# Altium schematic sheet Main.SchDoc
size A2; DocumentNumber: 1; SheetNumber: 1; SheetTotal: 2; Organization: Công ty cổ phần giải pháp và thiết bị VHB Việt Nam; Address1: KDT Dương Nội, Hà Đông, Hà Nội; SPICEModelCache: <root> / <DocumentId>GUMLTXHH</DocumentId> / </root>
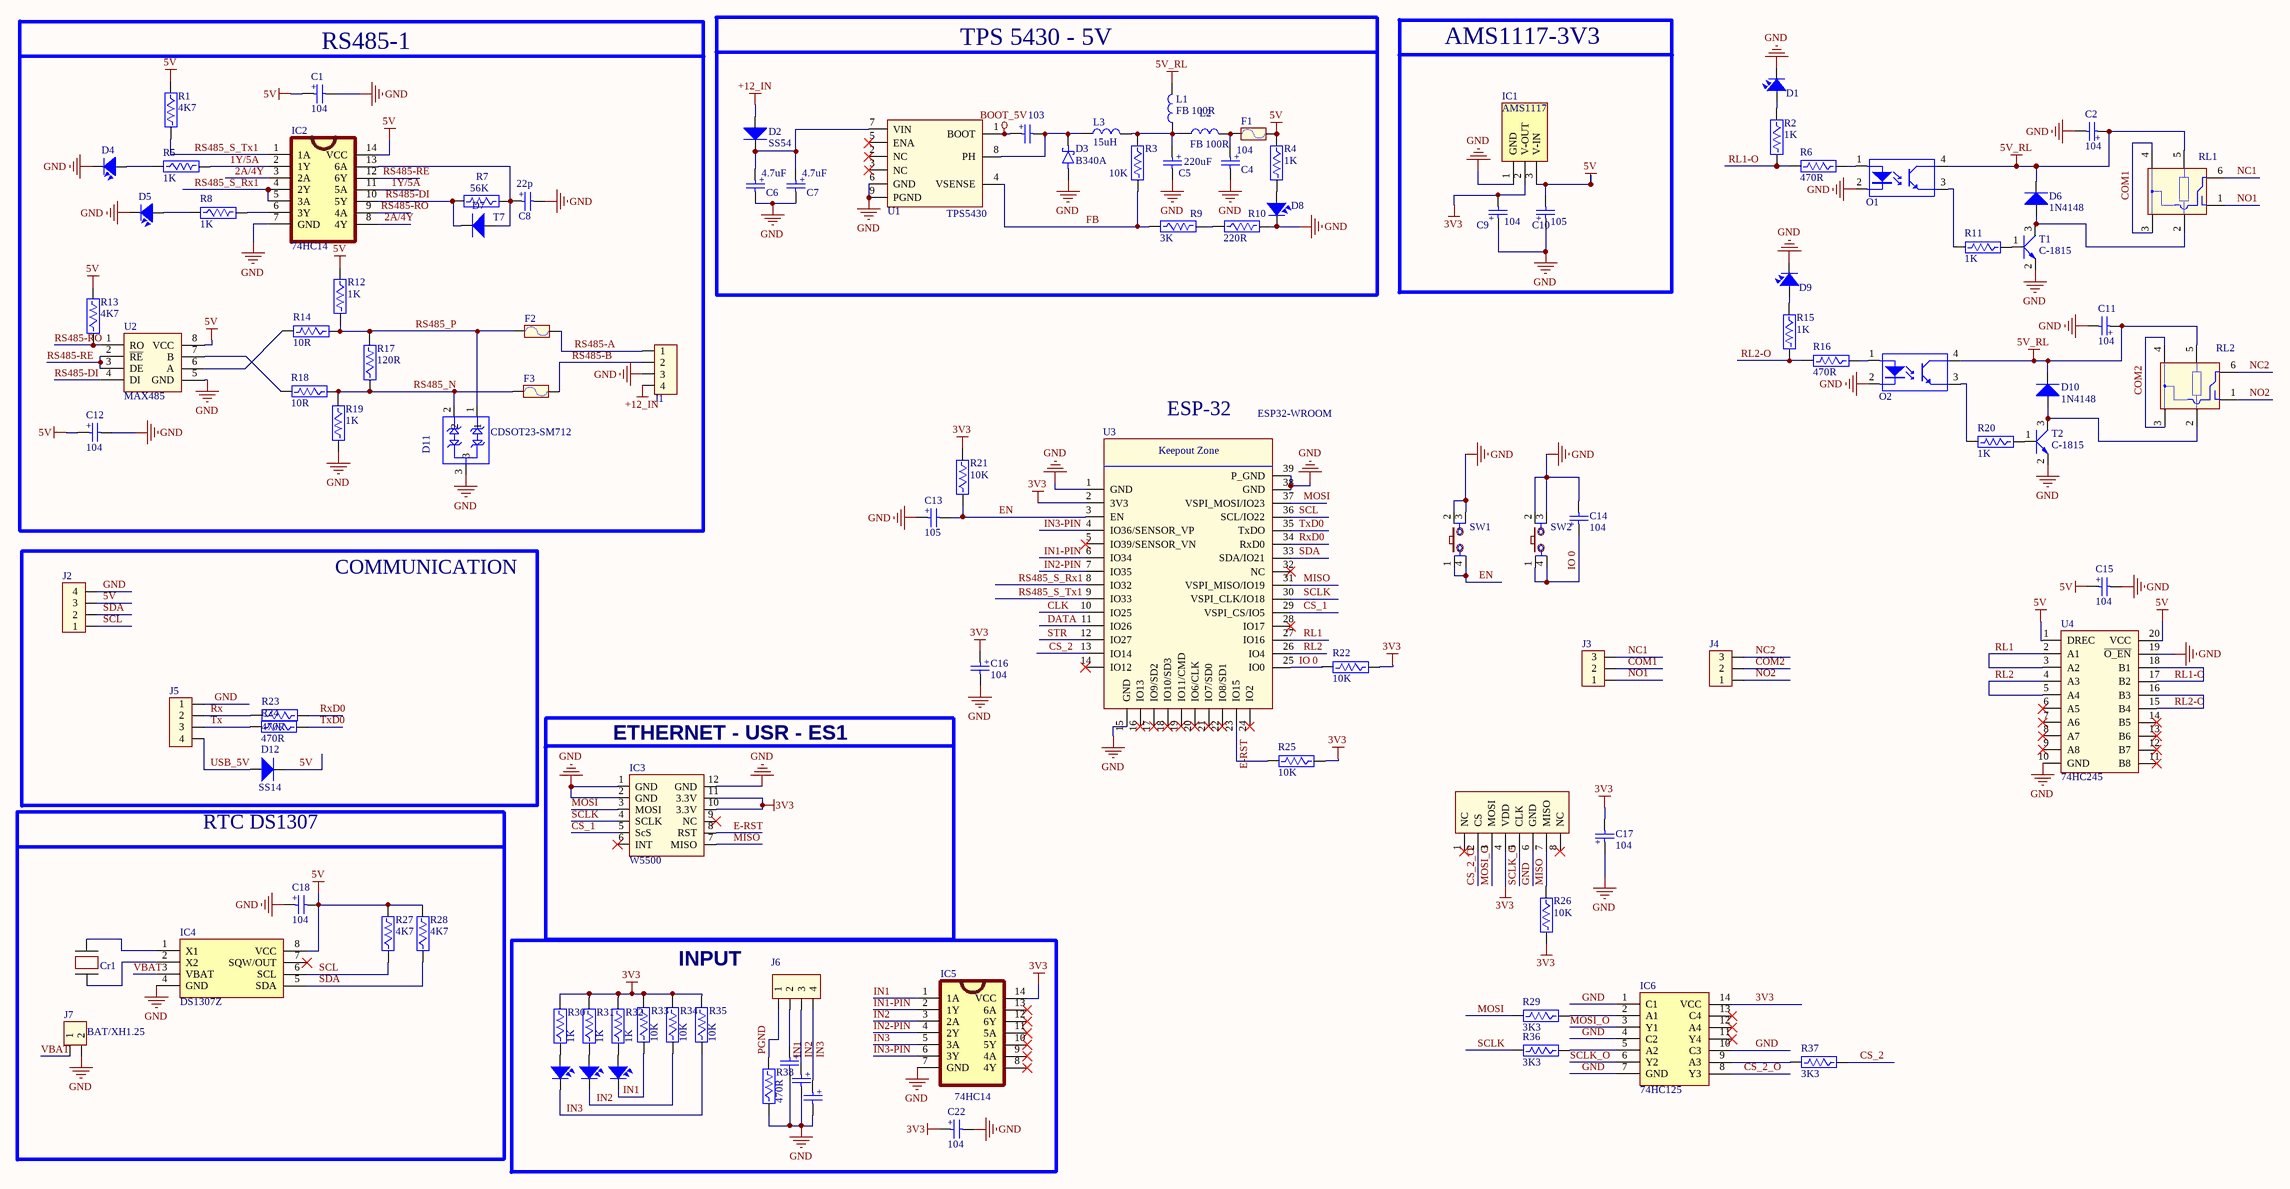
[diagram p0: Main.SchDoc]

## Parts
C1  104  [CAP 0805]
C2  104  [CAP 0805]
C3  103  [CAP 0805]
C4  104  [CAP 0805]
C5  220uF  [Capacitor 6x11]
C6  4.7uF  [CAP 0805]
C7  4.7uF  [CAP 0805]
C8  22p  [CAP 0805]
C9  104  [CAP 0805]
C10  105  [CAP 0805]
C11  104  [CAP 0805]
C12  104  [CAP 0805]
C13  105  [CAP 0805]
C14  104  [CAP 0805]
C15  104  [CAP 0805]
C16  104  [CAP 0805]
C17  104  [CAP 0805]
C18  104  [CAP 0805]
C19  104  [CAP 0805]  (value not drawn)
C20  104  [CAP 0805]  (value not drawn)
C21  104  [CAP 0805]  (value not drawn)
C22  104  [CAP 0805]
Cr1  FC135  [FC135327680KAAG0]  (value not drawn)
D1  LED RED 0805  [LED SMD 0805]  (value not drawn)
D2  SS54  [Diode SMB]
D3  B340A  [Diode Schotky]
D4  LED RED 0805  [LED SMD 0805]  (value not drawn)
D5  LED RED 0805  [LED SMD 0805]  (value not drawn)
D6  1N4148  [1N4848]
D7  T7  [Diode SMD]
D8  LED RED 0805  [LED SMD 0805]  (value not drawn)
D9  LED RED 0805  [LED SMD 0805]  (value not drawn)
D10  1N4148  [1N4848]
D11  M1_VALUE: CDSOT23-SM712  [SOT-23-3]  (hidden comment: SM712)
D12  SS14  [Diode SMB]
D13  LED RED 0805  [LED SMD 0805]  (value not drawn)
D14  LED RED 0805  [LED SMD 0805]  (value not drawn)
D15  LED RED 0805  [LED SMD 0805]  (value not drawn)
F1  Fuse 1812/6V  [fuse 1812]  (value not drawn)
F2  Fuse 0805/15V  [Fuse-0805]  (value not drawn)
F3  Fuse 0805/15V  [Fuse-0805]  (value not drawn)
IC1  ASM1117/3V3  [ASM1117]  (value not drawn)
IC2  74HC14  [SOP14]
IC3  W5500  [W5500-USR-ES1]
IC4  DS1307Z  [SOIC127P600X175-8N]
IC5  74HC14  [SOP14]
IC6  74HC125  [SOP65P640X120-14N]
J1  KF128-5.08-4P  [CON 4 KF128 5.08]  (value not drawn)
J2  XH2.54-4P-C  [XH-2.54 4P-T]  (value not drawn)
J3  KF128 5.08-3P  [CON KF128-3P]  (value not drawn)
J4  KF128 5.08-3P  [CON KF128-3P]  (value not drawn)
J5  XH2.54-4P-C  [XH-2.54 4P-C]  (value not drawn)
J6  KF128-5.08-4P  [CON 4 KF128 5.08]  (value not drawn)
J7  BAT/XH1.25  [Header 1.25]
L1  FB 100R  [L-Inductor 0805]
L2  FB 100R  [L-Inductor 0805]
L3  15uH  [Inductor CD75]
Mini_SDCard1  SD?  [Mini SDCard]  (value not drawn)
O1  EL3H7  [SOIC127P700X200-4N]  (value not drawn)
O2  EL3H7  [SOIC127P700X200-4N]  (value not drawn)
R1  4K7  [Res 0805]
R2  1K  [Res 0805]
R3  10K  [Res 0805]
R4  1K  [Res 0805]
R5  1K  [Res 0805]
R6  470R  [Res 0805]
R7  56K  [Res 0805]
R8  1K  [Res 0805]
R9  3K  [Res 0805]
R10  220R  [Res 0805]
R11  1K  [Res 0805]
R12  1K  [Res 0805]
R13  4K7  [Res 0805]
R14  10R  [Res 0805]
R15  1K  [Res 0805]
R16  470R  [Res 0805]
R17  120R  [Res 0805]
R18  10R  [Res 0805]
R19  1K  [Res 0805]
R20  1K  [Res 0805]
R21  10K  [Res 0805]
R22  10K  [Res 0805]
R23  470R  [Res 0805]
R24  470R  [Res 0805]
R25  10K  [Res 0805]
R26  10K  [Res 0805]
R27  4K7  [Res 0805]
R28  4K7  [Res 0805]
R29  3K3  [Res 0805]
R30  1K  [Res 0805]
R31  1K  [Res 0805]
R32  1K  [Res 0805]
R33  10K  [Res 0805]
R34  10K  [Res 0805]
R35  10K  [Res 0805]
R36  3K3  [Res 0805]
R37  3K3  [Res 0805]
R38  470R  [Res 0805]
RL1  Relay-HK4100F/12V  [HK4100FDC5VSHG]  (value not drawn)
RL2  Relay-HK4100F/12V  [HK4100FDC5VSHG]  (value not drawn)
SW1  SW  [SW2-SMD]  (value not drawn)
SW2  SW  [SW2-SMD]  (value not drawn)
T1  C-1815  [SOT23]
T2  C-1815  [SOT23]
U1  TPS5430  [SOIC127P600X170-9N]
U2  MAX485  [MAX485  SOP8]
U3  ESP32-WROOM  [ESP32WROOM32UEM113EH2800UH3Q0]
U4  74HC245  [74HC245-TSSOP20-4.4mm]

## Blocks framed on the sheet
RS485-1: C1 C8 C12 D4 D5 D7 D11 F2 F3 IC2 J1 R1 R5 R7 R8 R12-R14 R17-R19 U2
TPS 5430 - 5V: C3-C7 D2 D3 D8 F1 L1-L3 R3 R4 R9 R10 U1
AMS1117-3V3: C9 C10 IC1
COMMUNICATION: D12 J2 J5 R23 R24
ETHERNET - USR - ES1: IC3
RTC DS1307: C18 Cr1 IC4 J7 R27 R28
INPUT: C19-C22 D13-D15 IC5 J6 R30-R35 R38

## Nets
3V3: C9.2 C16.1 C17.2 C22.1 IC1.2(V-OUT) IC3.10(3.3V) IC3.11(3.3V) IC5.14(VCC) IC6.14(VCC) Mini_SDCard1.4(VDD) R21.2 R22.1 R25.1 R26.2 R30.2 R31.2 R32.2 R33.2 R34.2 R35.2 U3.2(3V3)
5V: C1.1 C10.2 C12.1 C15.1 C18.2 D12.2(K) F1.2 IC1.3(V-IN) IC2.14(VCC) IC4.8(VCC) J2.3 R1.1 R4.1 R12.1 R13.2 R27.2 R28.2 U2.8(VCC) U4.1(DREC) U4.20(VCC)
5V_RL: C2.1 C11.1 D6.K D10.K L1.2 O1.4(C) O2.4(C) RL1.5(COIL2) RL2.5(COIL2)
+12_IN: D2.1(A) J1.4
BOOT_5V: C3.1 U1.1(BOOT)
GND: C1.2 C2.2 C4.2 C5.2 C6.2 C7.2 C8.2 C9.1 C10.1 C11.2 C12.2 C13.1 C14.2 C15.2 C16.2 C17.1 C18.1 C19.2 C20.2 C21.2 C22.2 D1.2 D3.A D4.2 D5.2 D8.2 D9.2 D11.3 IC1.1(GND) IC2.7(GND) IC3.1(GND) IC3.2(GND) IC3.12(GND) IC4.4(GND) IC5.7(GND) IC6.1(C1) IC6.4(C2) IC6.7(GND) IC6.10(C3) J1.3 J2.4 J5.1 J7.2 Mini_SDCard1.6(GND) O1.2(K) O2.2(K) R10.2 R19.2 R38.1 SW1.2 SW1.3 SW2.2 SW2.3 T1.2(E) T2.2(E) U1.6(GND) U1.9(PGND) U2.5(GND) U3.1(GND) U3.15(GND) U3.38(GND) U3.39(P_GND) U4.10(GND) U4.19(~{O_EN})
1Y/5A: IC2.2(1Y) IC2.11(5A) R5.2
2A/4Y: IC2.3(2A) IC2.8(4Y)
CLK: U3.10(IO25)
COM1: J3.2 RL1.3(COM) RL1.4(COM)
COM2: J4.2 RL2.3(COM) RL2.4(COM)
CS_1: IC3.5(ScS) U3.29(VSPI_CS/IO5)
CS_2: R37.1 U3.13(IO14)
CS_2_O: IC6.8(Y3) Mini_SDCard1.2(CS)
DATA: U3.11(IO26)
E-RST: IC3.8(RST) R25.2 U3.23(IO15)
EN: C13.2 R21.1 SW1.1 SW1.4 U3.3(EN)
FB: R3.2 R9.1 U1.4(VSENSE)
IN1: C19.1 D15.2 IC5.1(1A) J6.2 R33.1
IN1-PIN: IC5.2(1Y) U3.6(IO34)
IN2: C20.1 D14.2 IC5.3(2A) J6.3 R34.1
IN2-PIN: IC5.4(2Y) U3.7(IO35)
IN3: C21.1 D13.2 IC5.5(3A) J6.4 R35.1
IN3-PIN: IC5.6(3Y) U3.4(IO36/SENSOR_VP)
IO 0: C14.1 R22.2 SW2.1 SW2.4 U3.25(IO0)
MISO: IC3.7(MISO) Mini_SDCard1.7(MISO) R26.1 U3.31(VSPI_MISO/IO19)
MOSI: IC3.3(MOSI) R29.2 U3.37(VSPI_MOSI/IO23)
MOSI_O: IC6.3(Y1) Mini_SDCard1.3(MOSI)
NC1: J3.3 RL1.6(NO)
NC2: J4.3 RL2.6(NO)
NO1: J3.1 RL1.1(NC)
NO2: J4.1 RL2.1(NC)
PGND: J6.1 R38.2
RL1: U3.27(IO16) U4.2(A1) U4.3(A2)
RL1-O: R2.2 R6.2 U4.17(B2) U4.18(B1)
RL2: U3.26(IO4) U4.4(A3) U4.5(A4)
RL2-O: R15.2 R16.2 U4.15(B4) U4.16(B3)
RS485-A: F2.2 J1.1
RS485-B: F3.2 J1.2
RS485-DI: D7.2(K) IC2.10(5Y) R7.2 U2.4(DI)
RS485-RE: IC2.12(6Y) U2.2(~{RE}) U2.3(DE)
RS485-RO: IC2.9(4A) R13.1 U2.1(RO)
RS485_N: D11.2 F3.1 R17.1 R18.1 R19.1
RS485_P: D11.1 F2.1 R12.2 R14.1 R17.2
RS485_S_Rx1: IC2.4(2Y) IC2.5(3A) U3.8(IO32)
RS485_S_Tx1: IC2.1(1A) R1.2 U3.9(IO33)
Rx: J5.2 R23.2
RxD0: R23.1 U3.34(RxD0)
SCL: IC4.6(SCL) J2.1 R27.1 U3.36(SCL/IO22)
SCLK: IC3.4(SCLK) R36.2 U3.30(VSPI_CLK/IO18)
SCLK_O: IC6.6(Y2) Mini_SDCard1.5(CLK)
SDA: IC4.5(SDA) J2.2 R28.1 U3.33(SDA/IO21)
STR: U3.12(IO27)
Tx: J5.3 R24.2
TxD0: R24.1 U3.35(TxDO)
USB_5V: D12.1(A) J5.4
VBAT: IC4.3(VBAT) J7.1
NetC3_2: C3.2 D3.K L3.1 U1.8(PH)
NetC4_1: C4.1 F1.1 L2.2
NetC5_1: C5.1 L1.1 L2.1 L3.2 R3.1
NetC6_1: C6.1 C7.1 D2.2(K) U1.7(VIN)
NetC8_1: C8.1 D7.1(A) IC2.13(6A) R7.1
NetCr1_1: Cr1.1 IC4.2(X2)
NetCr1_2: Cr1.2 IC4.1(X1)
NetD1_1: D1.1 R2.1
NetD4_1: D4.1 R5.1
NetD5_1: D5.1 R8.1
NetD6_A: D6.A RL1.2(COIL1) T1.3(C)
NetD8_1: D8.1 R4.2
NetD9_1: D9.1 R15.1
NetD10_A: D10.A RL2.2(COIL1) T2.3(C)
NetD13_1: D13.1 R30.1
NetD14_1: D14.1 R31.1
NetD15_1: D15.1 R32.1
NetIC2_6: IC2.6(3Y) R8.2
NetIC6_2: IC6.2(A1) R29.1
NetIC6_5: IC6.5(A2) R36.1
NetIC6_9: IC6.9(A3) R37.2
NetO1_1: O1.1(A) R6.1
NetO1_3: O1.3(E) R11.2
NetO2_1: O2.1(A) R16.1
NetO2_3: O2.3(E) R20.2
NetR9_2: R9.2 R10.1
NetR11_1: R11.1 T1.1(B)
NetR14_2: R14.2 U2.6(A)
NetR18_2: R18.2 U2.7(B)
NetR20_1: R20.1 T2.1(B)

Not connected (* = marked no-connect by the designer): IC3 6(INT)* 9(NC)*; IC4 7(SQW/OUT)*; IC5 8(4Y)* 9(4A)* 10(5Y)* 11(5A)* 12(6Y)* 13(6A)*; IC6 11(Y4)* 12(A4)* 13(C4)*; Mini_SDCard1 1(NC)* 8(NC)*; U1 2(NC)* 3(NC)* 5(ENA)*; U3 5(IO39/SENSOR_VN)* 14(IO12)* 16(IO13)* 17(IO9/SD2)* 18(IO10/SD3)* 19(IO11/CMD)* 20(IO6/CLK)* 21(IO7/SD0)* 22(IO8/SD1)* 24(IO2)* 28(IO17)* 32(NC)*; U4 6(A5)* 7(A6)* 8(A7)* 9(A8)* 11(B8)* 12(B7)* 13(B6)* 14(B5)*

## Notes on the sheet
- ESP-32
- Project Name:
- Author:
- Checked:
- Size:
- Date:
- File:
- Sheet Name:
- A2
- Time:
- Approved:
- Rev:
- Sheet:
- of:
- (in symbol Capacitor) +
- (in symbol ESP32-WROOM) Keepout Zone

## Library data of the parts
C1-C22 = Capacitor
Cr1 = Crystal
D1 D4 D5 D8 D9 D13-D15 = Led Smd
D2 D7 D12 = Diode
D3 = Diode schottky
D11 = TVS-CDSOT23-SM712: TVS-DIODE;BIR-DIR,DUAL,400W,7.5V,SOT23,CDSOT23-SM712; M1_CATE: ESD/TVS; M1_CLASS: U3; M1_ITEM: PUR; M1_MANU1: Bourns Inc; M1_PROC: SM; M1_TYPE: TVS; M1_UNIT: PCS; PAKAGE: SOT23_N; M1_VIETTEL_CODE: 2810-000085; M1_DESC: TVS-DIODE;BIR-DIR,DUAL,400W,7.5V,SOT23,CDSOT23-SM712; M1_MANU1_PN: CDSOT23-SM712
F1-F3 = Fuse
IC1 = AMS1117
IC3 = W5500-USR-ES1
IC4 = DS1307Z: Integrated Circuit; Manufacturer_Name: Maxim Integrated; Datasheet Link: https://datasheets.maximintegrated.com/en/ds/DS1307.pdf; Height: 1.75mm; Manufacturer_Part_Number: DS1307Z; Mouser Part Number: 700-DS1307Z-NR; Mouser Price/Stock: https://www.mouser.co.uk/ProductDetail/Maxim-Integrated/DS1307Z?qs=1eQvB6Dk1vjw3IRIE9TdIQ%3D%3D
IC6 = MM74HC125MTCX: Integrated Circuit; Manufacturer_Name: onsemi; Height: 1.2mm; Manufacturer_Part_Number: MM74HC125MTCX; Mouser Part Number: 512-MM74HC125MTCX; Mouser Price/Stock: https://www.mouser.co.uk/ProductDetail/ON-Semiconductor-Fairchild/MM74HC125MTCX?qs=f8e5tgPJFBP9tH4ItwUo%252Bg%3D%3D; Arrow Part Number: MM74HC125MTCX; Arrow Price/Stock: https://www.arrow.com/en/products/mm74hc125mtcx/on-semiconductor
J1 J6 = Con4
J2 J5 = Header 4P
J3 J4 = Con3
J7 = Con2
L1-L3 = L-Inductor
Mini_SDCard1 = Mini SDCard
R1-R38 = Res
RL1 RL2 = Relay-HK4100F: ComponentLink1Description: Datasheet; ComponentLink1URL: https://www.snapeda.com/parts/HK4100F-DC5V-SHG/HUIKE/datasheet/
SW1 SW2 = SW4: Switch button 4 pin; Value: Button chip 4 pin
T1 T2 = Tranzitor
D6 D10 = 1N4148: ComponentLink1Description: Datasheet; ComponentLink1URL: https://www.vishay.com/docs/85557/ll4148.pdf
IC2 = 74HC14: ComponentLink1Description: Datasheet; ComponentLink1URL: https://www.mouser.com/datasheet/2/308/74HC14.REV1-34947.pdf
U1 = TPS5430: ComponentLink1Description: Datasheet; ComponentLink1URL: https://www.ti.com/lit/ds/symlink/tps5430.pdf?ts=1670776849209
U3 = ESP32-WROOM: ComponentLink1Description: Datasheet1; ComponentLink1URL: https://www.espressif.com/sites/default/files/documentation/esp32-wroom-32_datasheet_en.pdf; ComponentLink2Description: Datasheet2; ComponentLink2URL: https://cdn.sparkfun.com/datasheets/IoT/esp32_datasheet_en.pdf
U4 = 74HC245: ComponentLink1Description: Datasheet; ComponentLink1URL: https://www.mouser.com/datasheet/2/308/74HC245.REV1-69988.pdf